# EAGLE design WAVESeeed (EAGLE 6.1)
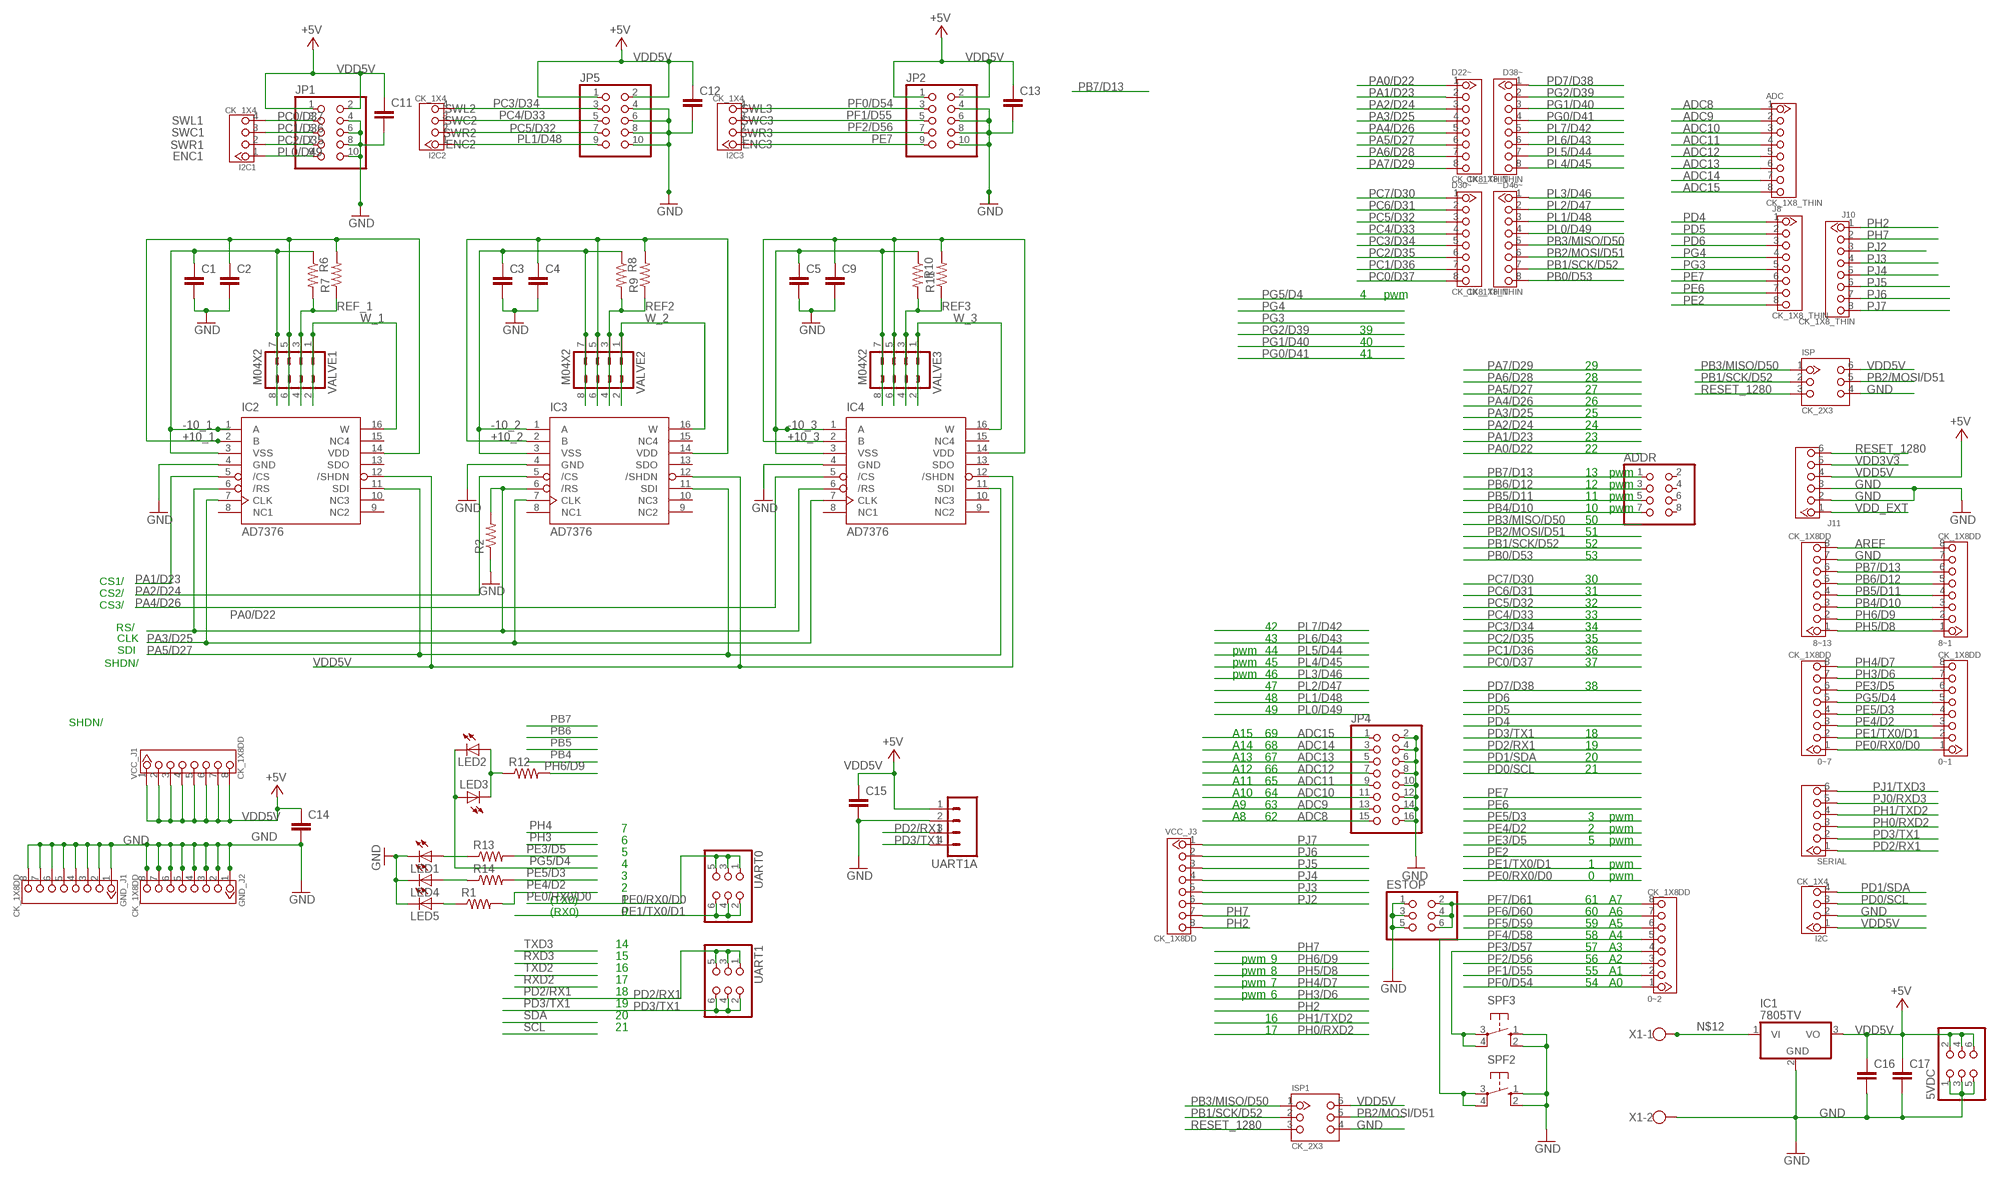
[diagram p0: schematic, sheet 1]

## Parts
0~1  CK_1X8DD  [CK_1X8]
0~2  CK_1X8DD  [CK_1X8]
0~7  CK_1X8DD  [CK_1X8]
5VDC  PINHD-2X3  [2X03]
8~1  CK_1X8DD  [CK_1X8]
8~13  CK_1X8DD  [CK_1X8]
ADC  CK_1X8_THIN  [CK_1X8_THIN]
ADDR  PINHD-2X4  [2X04]
C1  C-EUC1206  [C1206]
C2  C-EUC1206  [C1206]
C3  C-EUC1206  [C1206]
C4  C-EUC1206  [C1206]
C5  C-EUC1206  [C1206]
C9  C-EUC1206  [C1206]
C11  C-EUC1206  [C1206]
C12  C-EUC1206K  [C1206K]
C13  C-EUC1206K  [C1206K]
C14  C-EUC1206K  [C1206K]
C15  C-EUC1206  [C1206]
C16  C-EUC1206  [C1206]
C17  C-EUC1206K  [C1206K]
D22~  CK_1X8_THIN  [CK_1X8_THIN]
D30~  CK_1X8_THIN  [CK_1X8_THIN]
D38~  CK_1X8_THIN  [CK_1X8_THIN]
D46~  CK_1X8_THIN  [CK_1X8_THIN]
ESTOP  PINHD-2X3  [2X03]
GND_J1  CK_1X8DD  [CK_1X8]
GND_J2  CK_1X8DD  [CK_1X8]
I2C  CK_1X4  CK_1X4_DD  [CK_1X4]
I2C1  CK_1X4  CK_1X4_DD  [CK_1X4]
I2C2  CK_1X4  CK_1X4_DD  [CK_1X4]
I2C3  CK_1X4  CK_1X4_DD  [CK_1X4]
IC1  7805TV  [TO220V]
IC2  AD7376  [SO-16W]
IC3  AD7376  [SO-16W]
IC4  AD7376  [SO-16W]
ISP  CK_2X3  CK_2X3_THIN  [CK_2X3_THIN]
ISP1  CK_2X3  CK_2X3_THIN  [CK_2X3_THIN]
J8  CK_1X8_THIN  [CK_1X8_THIN]
J10  CK_1X8_THIN  [CK_1X8_THIN]
J11  CK_1X6  [CK_1X6]
JP1  PINHD-2X5  [2X05]
JP2  PINHD-2X5  [2X05]
JP4  PINHD-2X8  [2X08]
JP5  PINHD-2X5  [2X05]
LED1  LEDCHIPLED_1206  [CHIPLED_1206]
LED2  LEDCHIPLED_1206  [CHIPLED_1206]
LED3  LEDCHIPLED_1206  [CHIPLED_1206]
LED4  LEDCHIPLED_1206  [CHIPLED_1206]
LED5  LEDCHIPLED_1206  [CHIPLED_1206]
R1  R-US_R1206  [R1206]
R2  R-US_R1206  [R1206]
R6  R-US_M1206  [M1206]
R7  R-US_M1206  [M1206]
R8  R-US_M1206  [M1206]
R9  R-US_M1206  [M1206]
R10  R-US_M1206  [M1206]
R11  R-US_M1206  [M1206]
R12  R-US_R1206  [R1206]
R13  R-US_R1206  [R1206]
R14  R-US_R1206  [R1206]
SERIAL  CK_1X6  [CK_1X6]
SPF2  10-XX  [B3F-10XX]
SPF3  10-XX  [B3F-10XX]
UART0  PINHD-2X3  [2X03]
UART1  PINHD-2X3  [2X03]
UART1A  M04PTH  [1X04]
VALVE1  M04X2  [2X4]
VALVE2  M04X2  [2X4]
VALVE3  M04X2  [2X4]
VCC_J1  CK_1X8DD  [CK_1X8]
VCC_J3  CK_1X8DD  [CK_1X8]
X1  W237-102  [W237-102]

## Nets
+10_1: C2.1 IC2.2(B) IC2.14(VDD) R7.2 VALVE1.5 VALVE1.6
+10_2: C4.1 IC3.2(B) IC3.14(VDD) R9.2 VALVE2.5 VALVE2.6
+10_3: C9.1 IC4.2(B) IC4.14(VDD) R11.2 VALVE3.5 VALVE3.6
-10_1: C1.1 IC2.1(A) IC2.3(VSS) R6.1 VALVE1.7 VALVE1.8
-10_2: C3.1 IC3.1(A) IC3.3(VSS) R8.1 VALVE2.7 VALVE2.8
-10_3: C5.1 IC4.1(A) IC4.3(VSS) R10.1 VALVE3.7 VALVE3.8
ADC8: ADC.1 JP4.15
ADC9: ADC.2 JP4.13
ADC10: ADC.3 JP4.11
ADC11: ADC.4 JP4.9
ADC12: ADC.5 JP4.7
ADC13: ADC.6 JP4.5
ADC14: ADC.7 JP4.3
ADC15: ADC.8 JP4.1
AREF: 8~1.8 8~13.8
GND: 5VDC.1 5VDC.3 5VDC.5 8~1.7 8~13.7 C1.2 C2.2 C3.2 C4.2 C5.2 C9.2 C11.2 C12.2 C13.2 C14.2 C15.2 C16.2 C17.2 ESTOP.1 ESTOP.3 ESTOP.5 GND_J1.1 GND_J1.2 GND_J1.3 GND_J1.4 GND_J1.5 GND_J1.6 GND_J1.7 GND_J1.8 GND_J2.1 GND_J2.2 GND_J2.3 GND_J2.4 GND_J2.5 GND_J2.6 GND_J2.7 GND_J2.8 I2C.2 IC1.2(GND) IC2.4(GND) IC3.4(GND) IC4.4(GND) ISP1.4 ISP.4 J11.2 J11.3 JP1.4 JP1.6 JP1.8 JP1.10 JP2.4 JP2.6 JP2.8 JP2.10 JP4.2 JP4.4 JP4.6 JP4.8 JP4.10 JP4.12 JP4.14 JP4.16 JP5.4 JP5.6 JP5.8 JP5.10 LED1.C LED4.C LED5.C R2.1 SPF2.1(S) SPF2.2(S1) SPF3.1(S) SPF3.2(S1) UART1A.2 X1.2
N$1: LED2.A LED3.C R12.1
N$5: LED1.A R13.1
N$6: LED5.A R1.1
N$7: LED4.A R14.1
N$12: IC1.1(VI) X1.1
PA0/D22: D22~.1 IC2.6(/RS) IC3.6(/RS) IC4.6(/RS) R2.2
PA1/D23: D22~.2 IC2.5(/CS)
PA2/D24: D22~.3 IC3.5(/CS)
PA3/D25: D22~.4 IC2.7(CLK) IC3.7(CLK) IC4.7(CLK)
PA4/D26: D22~.5 IC4.5(/CS)
PA5/D27: D22~.6 IC2.11(SDI) IC3.11(SDI) IC4.11(SDI)
PA6/D28: D22~.7
PA7/D29: D22~.8
PB0/D53: D46~.8
PB1/SCK/D52: D46~.7 ISP1.2 ISP.2
PB2/MOSI/D51: D46~.6 ISP1.5 ISP.5
PB3/MISO/D50: D46~.5 ISP1.1 ISP.1
PB4/D10: 8~1.3 8~13.3 ADDR.7
PB5/D11: 8~1.4 8~13.4 ADDR.5
PB6/D12: 8~1.5 8~13.5 ADDR.3
PB7/D13: 8~1.6 8~13.6 ADDR.1
PC0/D37: D30~.8 I2C1.4 JP1.3
PC1/D36: D30~.7 I2C1.3 JP1.5
PC2/D35: D30~.6 I2C1.2 JP1.7
PC3/D34: D30~.5 I2C2.4 JP5.3
PC4/D33: D30~.4 I2C2.3 JP5.5
PC5/D32: D30~.3 I2C2.2 JP5.7
PC6/D31: D30~.2
PC7/D30: D30~.1
PD0/SCL: I2C.3
PD1/SDA: I2C.4
PD2/RX1: SERIAL.1 UART1.1 UART1.3 UART1.5 UART1A.3
PD3/TX1: SERIAL.2 UART1.2 UART1.4 UART1.6 UART1A.4
PD4: J8.1
PD5: J8.2
PD6: J8.3
PD7/D38: D38~.1
PE0/RX0/D0: 0~1.1 0~7.1 UART0.1 UART0.3 UART0.5
PE1/TX0/D1: 0~1.2 0~7.2 UART0.2 UART0.4 UART0.6
PE2: J8.8
PE3/D5: 0~1.6 0~7.6 R13.2
PE4/D2: 0~1.3 0~7.3 R1.2
PE5/D3: 0~1.4 0~7.4 R14.2
PE6: J8.7
PE7: I2C3.1 J8.6 JP2.9
PF0/D54: 0~2.1 I2C3.4 JP2.3
PF1/D55: 0~2.2 I2C3.3 JP2.5
PF2/D56: 0~2.3 I2C3.2 JP2.7
PF3/D57: 0~2.4 SPF3.3(P) SPF3.4(P1)
PF4/D58: 0~2.5 SPF2.3(P) SPF2.4(P1)
PF5/D59: 0~2.6
PF6/D60: 0~2.7
PF7/D61: 0~2.8 ESTOP.2 ESTOP.4 ESTOP.6
PG0/D41: D38~.4
PG1/D40: D38~.3
PG2/D39: D38~.2
PG3: J8.5
PG4: J8.4
PG5/D4: 0~1.5 0~7.5 LED2.C LED3.A
PH0/RXD2: SERIAL.3
PH1/TXD2: SERIAL.4
PH2: J10.1 VCC_J3.8
PH3/D6: 0~1.7 0~7.7
PH4/D7: 0~1.8 0~7.8
PH5/D8: 8~1.1 8~13.1
PH6/D9: 8~1.2 8~13.2 R12.2
PH7: J10.2 VCC_J3.7
PJ0/RXD3: SERIAL.5
PJ1/TXD3: SERIAL.6
PJ2: J10.3 VCC_J3.6
PJ3: J10.4 VCC_J3.5
PJ4: J10.5 VCC_J3.4
PJ5: J10.6 VCC_J3.3
PJ6: J10.7 VCC_J3.2
PJ7: J10.8 VCC_J3.1
PL0/D49: D46~.4 I2C1.1 JP1.9
PL1/D48: D46~.3 I2C2.1 JP5.9
PL2/D47: D46~.2
PL3/D46: D46~.1
PL4/D45: D38~.8
PL5/D44: D38~.7
PL6/D43: D38~.6
PL7/D42: D38~.5
REF2: R8.2 R9.1 VALVE2.3 VALVE2.4
REF3: R10.2 R11.1 VALVE3.3 VALVE3.4
REF_1: R6.2 R7.1 VALVE1.3 VALVE1.4
RESET_1280: ISP1.3 ISP.3 J11.6
VDD3V3: J11.5
VDD5V: 5VDC.2 5VDC.4 5VDC.6 C11.1 C12.1 C13.1 C14.1 C15.1 C16.1 C17.1 I2C.1 IC1.3(VO) IC2.12(/SHDN) IC3.12(/SHDN) IC4.12(/SHDN) ISP1.6 ISP.6 J11.4 JP1.1 JP1.2 JP2.1 JP2.2 JP5.1 JP5.2 UART1A.1 VCC_J1.1 VCC_J1.2 VCC_J1.3 VCC_J1.4 VCC_J1.5 VCC_J1.6 VCC_J1.7 VCC_J1.8 ; supply symbol labelled +5V
VDD_EXT: J11.1
W_1: IC2.16(W) VALVE1.1 VALVE1.2
W_2: IC3.16(W) VALVE2.1 VALVE2.2
W_3: IC4.16(W) VALVE3.1 VALVE3.2
Unconnected: ADDR.2 ADDR.4 ADDR.6 ADDR.8 IC2.8(NC1) IC2.9(NC2) IC2.10(NC3) IC2.13(SDO) IC2.15(NC4) IC3.8(NC1) IC3.9(NC2) IC3.10(NC3) IC3.13(SDO) IC3.15(NC4) IC4.8(NC1) IC4.9(NC2) IC4.10(NC3) IC4.13(SDO) IC4.15(NC4)

## Notes on the sheet
- SWL2 | SWL3
- SWL1 | SWC2 | SWC3
- SWC1 | SWR2 | SWR3
- SWR1 | ENC2 | ENC3
- ENC1
- 4 | pwm
- 39
- 40
- 41
- 29
- 28
- 27
- 26
- 25
- 24
- 23
- 22
- 13 | pwm
- 12 | pwm
- 11 | pwm
- 10 | pwm
- 50
- 51
- 52
- 53
- CS1/ | 30
- CS2/ | 31
- CS3/ | 32
- 33
- RS/ | 42 | 34
- CLK | 43 | 35
- SDI | pwm | 44 | 36
- SHDN/ | pwm | 45 | 37
- pwm | 46
- 47 | 38
- 48
- 49
- SHDN/
- A15 | 69 | 18
- A14 | 68 | 19
- A13 | 67 | 20
- A12 | 66 | 21
- A11 | 65
- A10 | 64
- A9 | 63
- A8 | 62 | 3 | pwm
- 7 | 2 | pwm
- 6 | 5 | pwm
- 5
- 4 | 1 | pwm
- 3 | 0 | pwm
- 2
- (TX0) | 1 | 61 | A7
- (RX0) | 0 | 60 | A6
- 59 | A5
- 58 | A4
- 14 | 57 | A3
- 15 | pwm | 9 | 56 | A2
- 16 | pwm | 8 | 55 | A1
- 17 | pwm | 7 | 54 | A0
- 18 | pwm | 6
- 19
- 20 | 16
- 21 | 17

## Library data of the parts
0~1 0~2 0~7 8~1 8~13 ADC D22~ D30~ D38~ D46~ GND_J1 GND_J2 J8 J10 VCC_J1 VCC_J3 = CONNECTER:CK_1X8
5VDC ESTOP UART0 UART1 = pinhead:PINHD-2X3: PIN HEADER
ADDR = pinhead:PINHD-2X4: PIN HEADER
C1-C5 C9 C11-C17 = rcl:C-EU: CAPACITOR, European symbol
I2C I2C1-I2C3 = CONNECTER:CK_1X4
IC1 = linear:78*: Positive VOLTAGE REGULATOR Source: http://cache.national.com/ds/LM/LM78L05.pdf http://www.fairchildsemi.com/ds/LM/LM7805.pdf
IC2-IC4 = analog-devices:AD7376: Digital pot
ISP ISP1 = CONNECTER:CK_2X3
J11 SERIAL = CONNECTER:CK_1X6
JP1 JP2 JP5 = pinhead:PINHD-2X5: PIN HEADER
JP4 = pinhead:PINHD-2X8: PIN HEADER
LED1-LED5 = led:LED: LED OSRAM: - CHIPLED LG R971, LG N971, LY N971, LG Q971, LY Q971, LO R971, LY R971 LH N974, LH R974 LS Q976, LO Q976, LY Q976 LO Q996 - Hyper CHIPLED LW Q18S LB Q993, LB Q99A, LB R99A - SideLED LS A670, LO A670, LY A670, LG A670, LP A670 LB A673, LV A673, LT A673, LW A673 LH A674 LY A675 LS A676, LA A676, LO A676, LY A676, LW A676 LS A679, LY A679, LG A679 - Hyper Micro SIDELED® LS Y876, LA Y876, LO Y876, LY Y876 LT Y87S - SmartLED LW L88C, LW L88S LB L89C, LB L89S, LG L890 LS L89K, LO L89K, LY L89K LS L896, LA L896, LO L896, LY L896 - TOPLED LS T670, LO T670, LY T670, LG T670, LP T670 LSG T670, LSP T670, LSY T670, LOP T670, LYG T670 LG T671, LOG T671, LSG T671 LB T673, LV T673, LT T673, LW T673 LH T674 LS T676, LA T676, LO T676, LY T676, LB T676, LH T676, LSB T676, LW T676 LB T67C, LV T67C, LT T67C, LS T67K, LO T67K, LY T67K, LW E67C LS E67B, LA E67B, LO E67B, LY E67B, LB E67C, LV E67C, LT E67C LW T67C LS T679, LY T679, LG T679 LS T770, LO T770, LY T770, LG T770, LP T770 LB T773, LV T773, LT T773, LW T773 LH T774 LS E675, LA E675, LY E675, LS T675 LS T776, LA T776, LO T776, LY T776, LB T776 LHGB T686 LT T68C, LB T68C - Hyper Mini TOPLED® LB M676 - Mini TOPLED Santana® LG M470 LS M47K, LO M47K, LY M47K Source: http://www.osram.convergy.de LUXEON: - LUMILED® LXK2-PW12-R00, LXK2-PW12-S00, LXK2-PW14-U00, LXK2-PW14-V00 LXK2-PM12-R00, LXK2-PM12-S00, LXK2-PM14-U00 LXK2-PE12-Q00, LXK2-PE12-R00, LXK2-PE12-S00, LXK2-PE14-T00, LXK2-PE14-U00 LXK2-PB12-K00, LXK2-PB12-L00, LXK2-PB12-M00, LXK2-PB14-N00, LXK2-PB14-P00, LXK2-PB14-Q00 LXK2-PR12-L00, LXK2-PR12-M00, LXK2-PR14-Q00, LXK2-PR14-R00 LXK2-PD12-Q00, LXK2-PD12-R00, LXK2-PD12-S00 LXK2-PH12-R00, LXK2-PH12-S00 LXK2-PL12-P00, LXK2-PL12-Q00, LXK2-PL12-R00 Source: www.luxeon.com KINGBRIGHT: KA-3528ASYC Source: www.kingbright.com
R1 R2 R6-R14 = resistor:R-US_: RESISTOR, American symbol
SPF2 SPF3 = switch-omron:10-XX: OMRON SWITCH; MPN: B3F-1000; OC_FARNELL: 176432; OC_NEWARK: 36M3542
UART1A = SparkFun-Connectors:M04: Header 4 Standard 4-pin 0.1" header. Use with straight break away headers (SKU : PRT-00116), right angle break away headers (PRT-00553), swiss pins (PRT-00743), machine pins (PRT-00117), and female headers (PRT-00115). Molex polarized connector foot print use with SKU : PRT-08231 with associated crimp pins and housings. 1MM SMD Version SKU: PRT-10208
VALVE1-VALVE3 = SparkFun-Connectors:M04X2: .1" header, two rows of four.
X1 = con-wago-500:W237-102: WAGO SCREW CLAMP; MPN: 237-102; OC_FARNELL: unknown; OC_NEWARK: 70K9898

## Net classes
0 default: width 0.152 mm, drill 0.305 mm, clearance 0.152 mm

## Board
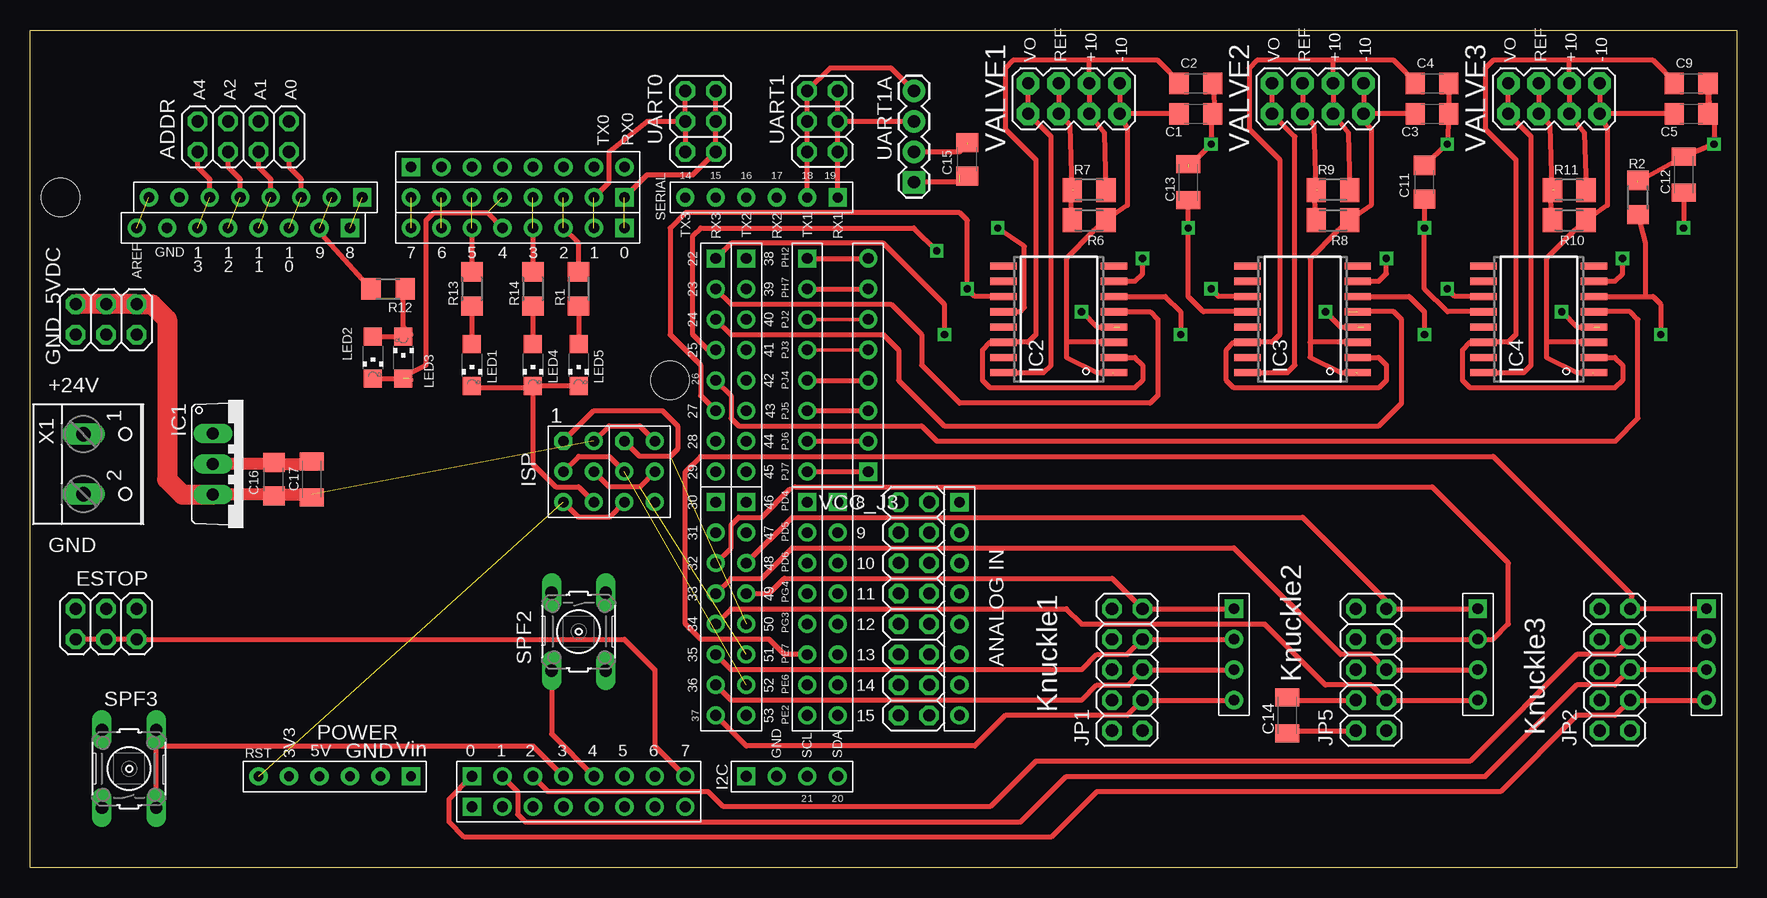
[diagram p1: board, top side]
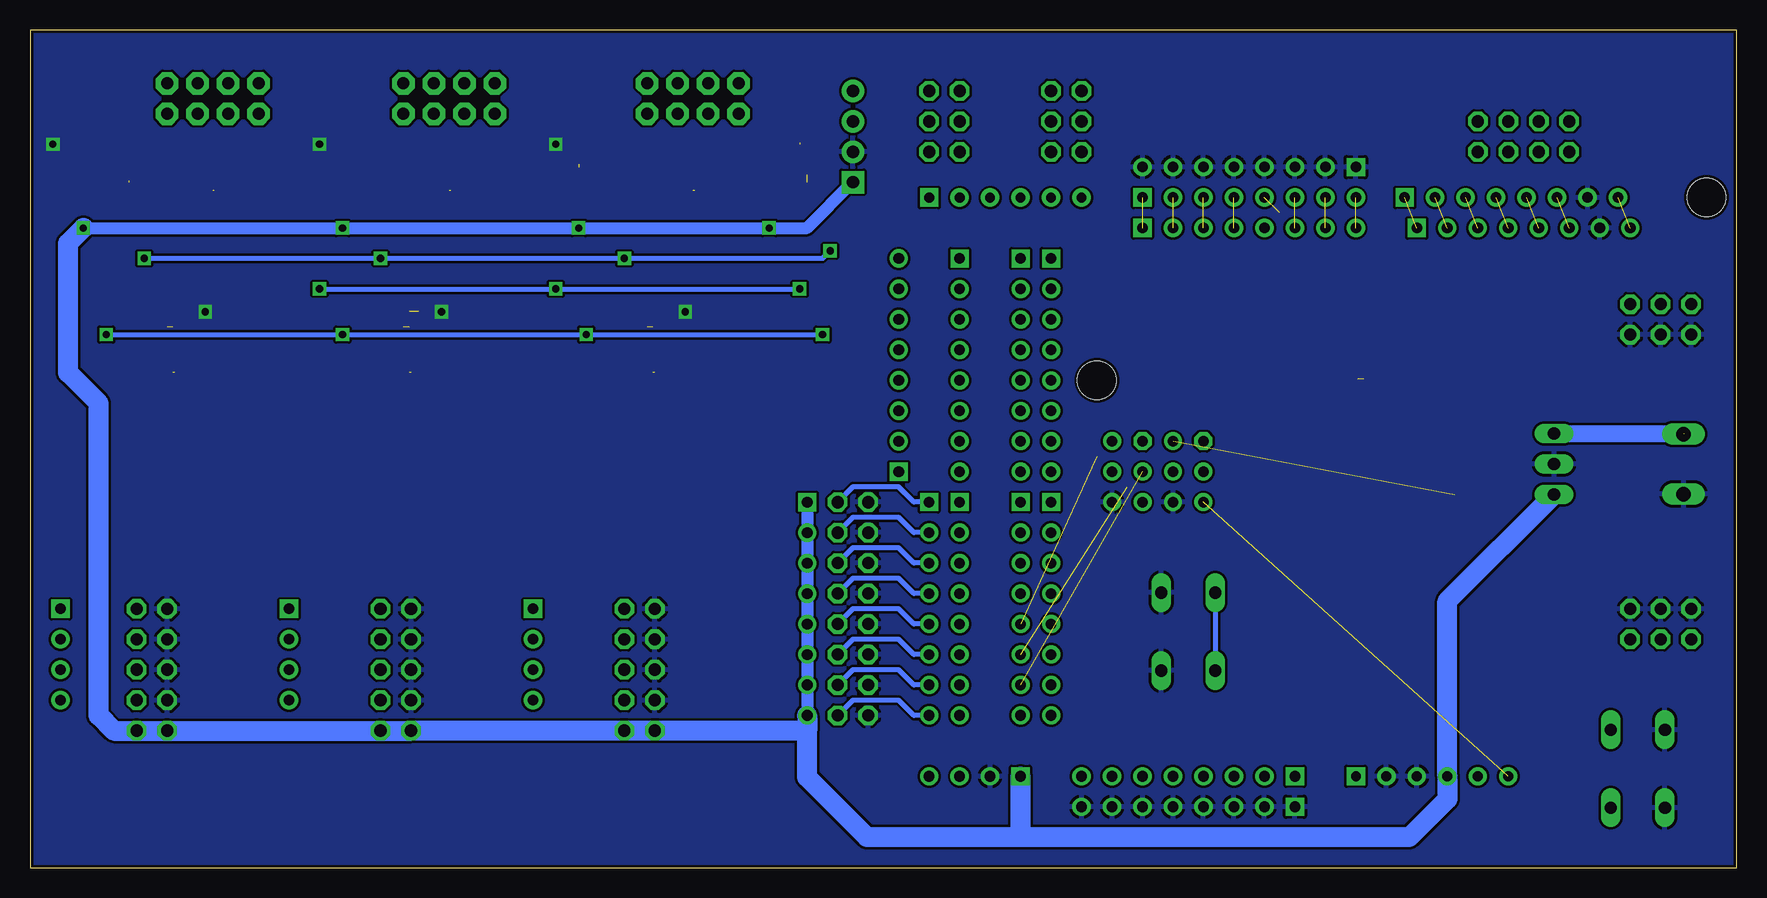
[diagram p2: board, bottom side, seen from below]

Size 142.24 x 69.85 mm. Coordinates in mm from the lower left corner, seen from the top.
Outline: 142.24,69.85 142.24,0 0,0 0,69.85 142.24,69.85
Copper layers (1*16): Top 0.035mm / dielectric 1.5mm / Bottom 0.035mm
Design rules: minimum track width 8mil, minimum drill 20mil, track to track 8mil, track to pad 8mil, pad to pad 8mil, via to via 8mil, smd to smd 8mil, copper to edge 10mil, drill to drill 8mil, minimum pad ring 12mil, minimum via ring 10mil, stop-mask expansion 4mil, vias tented up to drill 25mil, thermal gap 10mil
Holes 3.2 mm at 2.54,55.88 53.34,40.64
tRestrict: area 4.6,54.4 to 8.4,57.4

### Footprints (pad centres in the part's own frame; a part is rotated, then mirrored left to right if it is on the bottom)
CK_1X8 = drill 0.889 pad 1.524 square: 1 0,8.89 | drill 0.889 pad 1.524: 2 0,6.35; 3 0,3.81; 4 0,1.27; 5 0,-1.27; 6 0,-3.81; 7 0,-6.35; 8 0,-8.89
2X03 = drill 1.016 octagon: 1 -2.54,-1.27; 2 -2.54,1.27; 3 0,-1.27; 4 0,1.27; 5 2.54,-1.27; 6 2.54,1.27
CK_1X8_THIN = drill 0.889 pad 1.397 square: 1 0,8.89 | drill 0.889 pad 1.397: 2 0,6.35; 3 0,3.81; 4 0,1.27; 5 0,-1.27; 6 0,-3.81; 7 0,-6.35; 8 0,-8.89
2X04 = drill 1.016 octagon: 1 -3.81,-1.27; 2 -3.81,1.27; 3 -1.27,-1.27; 4 -1.27,1.27; 5 1.27,-1.27; 6 1.27,1.27; 7 3.81,-1.27; 8 3.81,1.27
C1206 = smd 1.6 x 1.8: 1 -1.4,0; 2 1.4,0
C1206K = smd 1.5 x 2: 1 -1.5,0; 2 1.5,0
CK_1X4 = drill 0.889 pad 1.524 square: 1 0,3.81 | drill 0.889 pad 1.524: 2 0,1.27; 3 0,-1.27; 4 0,-3.81
TO220V = drill 1.016 long: 1 -2.54,-2.54; 2 0,-2.54; 3 2.54,-2.54
SO-16W = smd 0.6 x 2.2: 1 -4.445,-4.6; 2 -3.175,-4.6; 3 -1.905,-4.6; 4 -0.635,-4.6; 5 0.635,-4.6; 6 1.905,-4.6; 7 3.175,-4.6; 8 4.445,-4.6; 9 4.445,4.6; 10 3.175,4.6; 11 1.905,4.6; 12 0.635,4.6; 13 -0.635,4.6; 14 -1.905,4.6; 15 -3.175,4.6; 16 -4.445,4.6
CK_2X3_THIN = drill 0.889 pad 1.397 octagon: 1 -1.27,2.54 | drill 0.889 pad 1.397: 2 -1.27,0; 3 -1.27,-2.54; 4 1.27,-2.54; 5 1.27,0; 6 1.27,2.54
CK_1X6@1 = drill 0.813 pad 1.524 square: 1 0,6.35 | drill 0.813 pad 1.524: 2 0,3.81; 3 0,1.27; 4 0,-1.27; 5 0,-3.81; 6 0,-6.35
2X05 = drill 1.016 octagon: 1 -5.08,-1.27; 2 -5.08,1.27; 3 -2.54,-1.27; 4 -2.54,1.27; 5 0,-1.27; 6 0,1.27; 7 2.54,-1.27; 8 2.54,1.27; 9 5.08,-1.27; 10 5.08,1.27
2X08 = drill 1.016 octagon: 1 -8.89,-1.27; 2 -8.89,1.27; 3 -6.35,-1.27; 4 -6.35,1.27; 5 -3.81,-1.27; 6 -3.81,1.27; 7 -1.27,-1.27; 8 -1.27,1.27; 9 1.27,-1.27; 10 1.27,1.27; 11 3.81,-1.27; 12 3.81,1.27; 13 6.35,-1.27; 14 6.35,1.27; 15 8.89,-1.27; 16 8.89,1.27
CHIPLED_1206 = smd 1.5 x 1.5: A 0,-1.75; C 0,1.75
R1206 = smd 1.6 x 1.803: 1 -1.422,0; 2 1.422,0
M1206 = smd 1.6 x 2: 1 -1.4,0; 2 1.4,0
B3F-10XX = drill 1.016 long: 1 -3.251,2.261; 2 3.251,2.261; 3 -3.251,-2.261; 4 3.251,-2.261
1X04 = drill 1.016 pad 1.88 square: 1 0,0 | drill 1.016 pad 1.88: 2 2.54,0; 3 5.08,0; 4 7.62,0
2X4 = drill 1.016 pad 1.88 octagon: 1 -3.81,-1.27; 2 -3.81,1.27; 3 -1.27,-1.27; 4 -1.27,1.27; 5 1.27,-1.27; 6 1.27,1.27; 7 3.81,-1.27; 8 3.81,1.27
W237-102 = drill 1.194 long: 1 -2.5,-1.27; 2 2.5,-1.27

### Placement (x,y rotation side)
0~1  40.64,53.34 270 top
0~2  45.72,7.62 90 top
0~7  40.64,55.88 270 top
5VDC  6.35,45.72 0 top
8~1  17.78,53.34 270 top
8~13  18.8,55.88 270 top
ADC  67.31,21.59 0 top
ADDR  17.78,60.96 0 top
C1  97.16,62.87 0 top
C2  97.16,65.41 0 top
C3  116.84,62.87 0 top
C4  116.84,65.41 0 top
C5  138.43,62.87 0 top
C9  138.43,65.41 0 top
C11  116.2,57.15 90 top
C12  137.79,57.78 90 top
C13  96.52,57.15 90 top
C14  104.78,12.7 90 top
C15  78.11,59.05 90 top
C16  20.32,32.38 90 top
C17  23.5,32.38 90 top
D22~  57.15,41.91 0 top
D30~  57.15,21.59 0 top
D38~  59.69,41.91 0 top
D46~  59.69,21.59 0 top
ESTOP  6.35,20.32 180 top
GND_J1  45.72,5.08 90 top
GND_J2  40.64,58.42 90 top
I2C  63.5,7.62 90 top
I2C1  100.33,17.78 0 top
I2C2  120.65,17.78 0 top
I2C3  139.7,17.78 0 top
IC1  17.78,33.66 270 top
IC2  85.72,45.72 90 top
IC3  106.05,45.72 90 top
IC4  125.73,45.72 90 top
ISP  50.8,33.02 0 top
ISP1  45.72,33.02 0 top
J8  64.77,21.59 0 top
J10  64.77,41.91 0 top
J11  [CK_1X6@1]  25.4,7.62 270 top
JP1  91.44,16.51 90 top
JP2  132.08,16.51 90 top
JP4  73.66,21.59 90 top
JP5  111.76,16.51 90 top
LED1  36.83,41.91 180 top
LED2  28.57,42.55 180 top
LED3  31.11,42.55 0 top
LED4  41.91,41.91 180 top
LED5  45.72,41.91 180 top
R1  45.72,48.26 90 top
R2  133.99,55.88 270 top
R6  88.27,53.98 180 top
R7  88.27,56.52 0 top
R8  108.58,53.98 180 top
R9  108.58,56.52 0 top
R10  128.27,53.98 180 top
R11  128.27,56.52 0 top
R12  29.84,48.26 180 top
R13  36.83,48.26 90 top
R14  41.91,48.26 90 top
SERIAL  [CK_1X6@1]  60.96,55.88 270 top
SPF2  45.72,19.68 270 top
SPF3  8.26,8.26 90 top
UART0  55.88,62.23 90 top
UART1  66.04,62.23 90 top
UART1A  73.66,57.15 90 top
VALVE1  87,64.14 0 top
VALVE2  107.31,64.14 0 top
VALVE3  127,64.14 0 top
VCC_J1  77.47,21.59 0 top
VCC_J3  69.85,41.91 180 top
X1  5.71,33.66 270 top

### Tracks (layer width: path | path; a pad name or v marks a point on that pad's centre or on a via)
+10_1
  Top 0.406: 88.27,67.31 VALVE1.6 VALVE1.5 89.53,61.28 R7.2 | 88.27,67.31 81.92,67.31 81.28,66.67 81.28,61.59 83.82,59.05 83.82,44.45 83.19,43.81 IC2.14 80.01,43.81 79.38,43.18 79.38,40.64 80.01,40.01 92.08,40.01 92.71,40.64 92.71,41.91 92.08,42.55 IC2.2 | C2.1 94.94,66.36 93.98,67.31 88.27,67.31
+10_2
  Top 0.406: 108.58,67.31 VALVE2.6 VALVE2.5 109.86,61.28 R9.2 | 108.58,67.31 102.23,67.31 101.6,66.67 101.6,61.59 104.14,59.05 104.14,44.45 103.5,43.81 IC3.14 100.33,43.81 99.69,43.18 99.69,40.64 100.33,40.01 112.39,40.01 113.03,40.64 113.03,41.91 112.39,42.55 IC3.2 | C4.1 114.62,66.36 113.67,67.31 108.58,67.31
+10_3
  Top 0.406: 128.27,67.31 VALVE3.6 VALVE3.5 129.54,61.28 R11.2 | 128.27,67.31 121.92,67.31 121.28,66.67 121.28,61.59 123.83,59.05 123.83,44.45 123.19,43.81 IC4.14 120.02,43.81 119.38,43.18 119.38,40.64 120.02,40.01 132.08,40.01 132.72,40.64 132.72,41.91 132.08,42.55 IC4.2 | C9.1 136.21,66.36 135.25,67.31 128.27,67.31
-10_1  (1 unrouted)
  Top 0.406: VALVE1.8 VALVE1.7 | VALVE1.7 91.44,61.59 91.44,55.24 R6.1 | R6.1 89.22,53.66 | R6.1 88.58,53.02 86.36,50.8 86.36,43.81 | 86.36,43.81 86.36,42.55 88.9,41.27 90.17,41.27 | IC2.3 86.36,43.81 | C1.1 VALVE1.7
-10_2  (1 unrouted)
  Top 0.406: VALVE2.8 VALVE2.7 | VALVE2.7 111.12,62.23 111.76,61.59 111.76,55.24 R8.1 | R8.1 110.17,54.29 | R8.1 108.9,53.02 106.68,50.8 106.68,43.81 | 106.68,43.81 106.68,42.55 109.22,41.27 110.49,41.27 | IC3.3 106.68,43.81 | C3.1 VALVE2.7
-10_3  (1 unrouted)
  Top 0.406: VALVE3.8 VALVE3.7 | VALVE3.7 131.44,61.59 131.44,55.24 R10.1 | R10.1 129.22,53.66 | R10.1 128.59,53.02 126.36,50.8 126.36,43.81 | 126.36,43.81 126.36,42.55 128.91,41.27 130.18,41.27 | IC4.3 126.36,43.81 | C5.1 VALVE3.7
ADC8
  Bottom 0.406: ADC.1 68.58,30.48 69.85,31.75 73.66,31.75 JP4.15
ADC9
  Bottom 0.406: ADC.2 68.58,27.94 69.85,29.21 73.66,29.21 JP4.13
ADC10
  Bottom 0.406: ADC.3 68.58,25.4 69.85,26.67 73.66,26.67 JP4.11
ADC11
  Bottom 0.406: ADC.4 68.58,22.86 69.85,24.13 73.66,24.13 JP4.9
ADC12
  Bottom 0.406: ADC.5 68.58,20.32 69.85,21.59 73.66,21.59 JP4.7
ADC13
  Bottom 0.406: ADC.6 68.58,17.78 69.85,19.05 73.66,19.05 JP4.5
ADC14
  Bottom 0.406: ADC.7 68.58,15.24 69.85,16.51 73.66,16.51 JP4.3
ADC15
  Bottom 0.406: ADC.8 68.58,12.7 69.85,13.97 73.66,13.97 JP4.1
AREF  (1 unrouted)
GND  (via drill 0.6)  (6 unrouted)
  Top 0.406: 41.91,40.01 LED4.C LED5.C | 41.91,40.01 36.98,40.01 LED1.C | 41.91,40.01 41.91,33.66 43.81,31.75 45.72,31.75 ISP1.4 | C2.2 98.74,63.18 98.42,62.87 | v87.63,46.35 88.9,45.09 90.81,45.09 | v107.95,46.35 109.22,45.09 111.12,45.09 | v127.64,46.35 128.91,45.09 130.81,45.09 | C4.2 C3.2 v118.11,60.33 C11.2 | C5.2 C9.2 140.01,62.55 140.34,62.23 v140.34,60.33 C12.2 133.99,57.15 | C1.2 98.42,62.87 | 98.42,62.87 v98.42,60.33 96.52,58.42 | UART1A.2 77.47,59.69 78.11,60.33 | C14.2 104.78,13.97 JP5.4
  Top 1.016: 20.32,33.66 23.5,33.66 C17.2 | C16.2 20.32,33.66 | 20.32,33.66 IC1.2
  pour Bottom: 142.24,69.85 142.24,0 73.66,-0.51 0,0.13 0,36.7 0.25,69.72
N$1
  Top 0.406: LED2.A LED3.C 31.75,44.45 31.11,45.09 31.11,48.11 R12.1
N$5
  Top 0.406: R13.1 LED1.A
N$6
  Top 0.406: R1.1 LED5.A
N$7
  Top 0.406: 41.91,46.99 R14.1 LED4.A
N$12  (1 unrouted)
  Bottom 1.422: IC1.1 4.45,36.2
PA0/D22  (via drill 0.6)
  Top 0.406: v76.2,44.45 76.2,46.99 71.12,52.07 58.42,52.07 D22~.1 | IC2.6 94.61,47.62 95.89,46.35 v95.89,44.45 | IC4.6 134.62,47.62 | 134.62,47.62 135.25,47.62 135.89,46.99 v135.89,44.45 | IC3.6 114.94,47.62 116.2,46.35 v116.2,44.45 | R2.2 134.62,52.07 134.62,47.62
  Bottom 0.406: v135.89,44.45 v116.2,44.45 v95.89,44.45 v76.2,44.45
PA1/D23
  Top 0.406: D22~.2 58.42,46.99 71.75,46.99 74.3,44.45 74.3,41.91 77.47,38.73 93.34,38.73 93.98,39.37 93.98,45.72 93.34,46.35 IC2.5
PA2/D24  (1 unrouted)
  Top 0.406: D22~.3 58.42,44.45 71.12,44.45 72.39,43.18 72.39,40.64 76.2,36.83 112.39,36.83 114.3,38.73 114.3,45.72 113.67,46.35 109.86,46.35
PA3/D25  (via drill 0.6)
  Top 0.406: D22~.4 56.52,43.18 55.24,44.45 55.24,52.7 55.88,53.34 73.66,53.34 v75.56,51.44 | IC2.7 92.08,48.9 92.71,49.53 v92.71,50.8 | IC3.7 112.39,48.9 113.03,49.53 v113.03,50.8 | IC4.7 132.08,48.9 132.72,49.53 v132.72,50.8
  Bottom 0.406: v132.72,50.8 v113.03,50.8 v92.71,50.8 76.2,50.8 v75.56,51.44
PA4/D26
  Top 0.406: D22~.5 58.42,39.37 58.42,37.47 59.05,36.83 74.3,36.83 75.56,35.56 127.6,35.56 127.65,35.56 127.67,35.56 127.69,35.56 132.14,35.57 133.99,37.47 133.99,45.72 133.35,46.35 IC4.5
PA5/D27  (via drill 0.6)
  Top 0.406: IC2.11 78.74,47.62 v78.11,48.26 78.11,53.98 77.47,54.61 54.61,54.61 53.34,53.34 53.34,44.45 55.88,41.91 55.88,39.37 D22~.6 | IC3.11 99.06,47.62 v98.42,48.26 | IC4.11 118.75,47.62 v118.11,48.26
  Bottom 0.406: v78.11,48.26 v98.42,48.26 v118.11,48.26
PB1/SCK/D52  (1 unrouted)
  Top 0.406: ISP1.2 45.72,34.29 48.26,34.29 ISP.2
PB2/MOSI/D51  (1 unrouted)
  Top 0.406: ISP.5 50.8,31.75 48.26,31.75 ISP1.5
PB3/MISO/D50  (1 unrouted)
  Top 0.406: ISP1.1 46.99,38.1 52.7,38.1 53.98,36.83 53.98,34.92 53.34,34.29 50.8,34.29 ISP.1
PB4/D10  (1 unrouted)
  Top 0.406: 8~13.3 22.61,57.4 21.59,58.42 ADDR.7
PB5/D11  (1 unrouted)
  Top 0.406: 8~13.4 20.07,57.4 19.05,58.42 ADDR.5
PB6/D12  (1 unrouted)
  Top 0.406: 8~13.5 17.53,57.4 16.51,58.42 ADDR.3
PB7/D13  (1 unrouted)
  Top 0.406: 8~13.6 14.99,57.4 13.97,58.42 ADDR.1
PC0/D37
  Top 0.406: D30~.8 59.69,10.16 78.74,10.16 81.28,12.7 91.44,12.7 JP1.3 I2C1.4
PC1/D36
  Top 0.406: D30~.7 58.42,13.97 87.63,13.97 88.9,15.24 91.57,15.24 JP1.5 I2C1.3
PC2/D35
  Top 0.406: D30~.6 58.42,16.51 87.63,16.51 88.9,17.78 91.44,17.78 JP1.7 I2C1.2
PC3/D34
  Top 0.406: D30~.5 58.42,21.59 86.36,21.59 87.63,20.32 102.87,20.32 107.95,15.24 111.76,15.24 JP5.3 I2C2.4
PC4/D33
  Top 0.406: D30~.4 58.42,24.13 60.96,24.13 63.5,26.67 100.33,26.67 109.22,17.78 111.76,17.78 JP5.5 I2C2.3
PC5/D32
  Top 0.305: 63.31,31.56 63.76,31.75
  Top 0.406: D30~.3 58.42,26.67 58.42,28.57 59.05,29.21 60.96,29.21 63.31,31.56 | 63.76,31.75 116.84,31.75 123.19,25.4 123.19,20.32 121.92,19.05 I2C2.2 JP5.7
PD2/RX1
  Top 0.406: SERIAL.1 UART1.1 UART1.3 | UART1.3 UART1.5 | UART1.3 UART1A.3
PD3/TX1
  Top 0.406: SERIAL.2 UART1.2 UART1.4 UART1.6 66.67,66.67 71.75,66.67 UART1A.4
PE0/RX0/D0  (1 unrouted)
  Top 0.406: 0~7.1 51.44,57.78 55.24,57.78 UART0.1 UART0.3 UART0.5
PE1/TX0/D1  (1 unrouted)
  Top 0.406: 0~7.2 48.26,57.15 48.26,59.69 51.44,62.23 UART0.4 | UART0.4 UART0.6 | UART0.4 UART0.2
PE3/D5  (1 unrouted)
  Top 0.406: 0~1.6 R13.2
PE4/D2  (1 unrouted)
  Top 0.406: R1.2 45.72,52.07 0~1.3
PE5/D3  (1 unrouted)
  Top 0.406: 0~1.4 R14.2
PE7
  Top 0.406: J8.6 62.87,17.78 61.59,19.05 55.88,19.05 54.61,20.32 54.61,33.02 55.88,34.29 121.92,34.29 133.48,22.73 JP2.9 I2C3.1
PF0/D54
  Top 0.406: 0~2.1 34.92,5.71 34.92,3.81 36.2,2.54 85.09,2.54 88.9,6.35 122.56,6.35 128.91,12.7 132.08,12.7 JP2.3 I2C3.4
PF1/D55
  Top 0.406: 0~2.2 40.64,6.35 40.64,4.45 41.27,3.81 82.55,3.81 86.36,7.62 121.28,7.62 128.91,15.24 132.08,15.24 JP2.5 I2C3.3
PF2/D56
  Top 0.406: 0~2.3 43.18,6.35 56.52,6.35 57.78,5.08 80.01,5.08 83.82,8.89 120.02,8.89 128.91,17.78 132.08,17.78 JP2.7 I2C3.2
PF3/D57
  Top 0.406: 0~2.4 41.91,10.16 10.52,10.16 | SPF3.3 10.52,10.16 | 10.52,10.16 10.52,11.15 | 10.52,11.15 10.79,11.43 | SPF3.4 10.52,11.15
PF4/D58
  Top 0.406: SPF2.4 43.46,11.15 0~2.5
  Bottom 0.406: SPF2.3 SPF2.4
PF7/D61
  Top 0.406: ESTOP.6 ESTOP.4 ESTOP.2 49.53,19.05 52.07,16.51 52.07,10.16 0~2.8
PG5/D4  (2 unrouted)
  Top 0.406: LED2.C 31.59,40.8 31.75,40.64 | LED3.A 31.75,41.27 33.02,41.91 33.02,53.98 33.66,54.61 38.1,54.61 0~1.5
PH2
  Top 0.406: J10.1 VCC_J3.8
PH3/D6  (1 unrouted)
PH4/D7  (1 unrouted)
PH5/D8  (1 unrouted)
PH6/D9  (1 unrouted)
  Top 0.406: R12.2 23.98,53.19 8~1.2
PH7
  Top 0.406: J10.2 VCC_J3.7
PJ2
  Top 0.305: J10.3 VCC_J3.6
PJ3
  Top 0.305: J10.4 VCC_J3.5
PJ4
  Top 0.406: J10.5 VCC_J3.4
PJ5
  Top 0.406: J10.6 VCC_J3.3
PJ6
  Top 0.406: J10.7 VCC_J3.2
PJ7
  Top 0.406: J10.8 VCC_J3.1
PL0/D49
  Top 0.406: D46~.4 61.59,22.86 62.87,24.13 90.17,24.13 JP1.9 I2C1.1
PL1/D48
  Top 0.406: D46~.3 63.5,29.21 106.05,29.21 113.03,22.23 JP5.9 I2C2.1
REF2  (1 unrouted)
  Top 0.406: VALVE2.4 VALVE2.3 107,61.91 R9.1 | R8.2 107,56.2 107.31,56.52
REF3  (1 unrouted)
  Top 0.406: VALVE3.4 VALVE3.3 126.69,61.91 R11.1 | R10.2 126.69,56.2 127,56.52
REF_1  (1 unrouted)
  Top 0.406: VALVE1.4 VALVE1.3 86.68,61.91 R7.1 | R6.2 86.68,56.84 87,56.52
RESET_1280  (1 unrouted)
  Top 0.406: ISP.3 48.26,29.21 45.72,29.21 ISP1.3
VDD5V  (via drill 0.6)  (2 unrouted)
  Top 0.305: C15.1 77.47,57.78
  Top 0.406: 96.2,55.56 C13.1 v96.52,53.34 96.52,47.62 97.79,46.35 IC3.12 | 116.2,55.88 C11.1 v116.2,53.34 116.2,48.26 118.11,46.35 IC4.12 | ISP.6 50.8,36.83 48.26,36.83 ISP1.6 | C12.1 v137.79,53.34 | IC2.12 82.55,46.35 82.87,46.74 82.87,51.82 v80.64,53.34 | 77.47,57.15 UART1A.1 | C14.1 104.78,11.43 JP5.2
  Top 1.016: 20.32,31.11 23.5,31.11 C17.1 | C16.1 20.32,31.11 | 20.32,31.11 IC1.3
  Top 1.676: 5VDC.2 5VDC.4 5VDC.6 10.16,46.99 11.43,45.72 11.43,32.38 12.7,31.11 IC1.3
  Bottom 1.016: VCC_J1.1 VCC_J1.2 VCC_J1.3 VCC_J1.4 VCC_J1.5 VCC_J1.6 VCC_J1.7 VCC_J1.8 | v137.79,53.34 v116.2,53.34 v96.52,53.34 v80.64,53.34 77.47,53.34 UART1A.1
  Bottom 1.676: VCC_J1.8 77.47,11.43 | 77.47,11.43 JP1.2 JP1.1 JP5.2 JP5.1 JP2.2 JP2.1 135.25,11.43 136.53,12.7 136.53,38.73 139.06,41.27 139.06,52.07 v137.79,53.34 | 59.69,2.54 72.47,2.54 77.47,7.54 77.47,11.43 | 59.69,2.54 27.3,2.54 24.13,5.71 J11.4 24.13,22.23 IC1.3 | 59.69,2.54 I2C.1
W_1
  Top 0.406: IC2.16 84.45,41.27 85.09,41.91 85.09,60.96 VALVE1.1 VALVE1.2
W_2
  Top 0.406: IC3.16 104.78,41.27 105.41,41.91 105.41,60.96 VALVE2.1 VALVE2.2
W_3
  Top 0.406: IC4.16 124.46,41.27 125.09,41.91 125.09,60.96 VALVE3.1 VALVE3.2

### Text on the board
tPlace: VO | REF | +10 | -10 | VO | REF | +10 | -10 | VO | REF | +10 | -10 | A4 | A2 | A1 | A0 | TX0 | RX0 | 14 | 15 | 16 | 17 | 18 | 19 | TX3 | RX3 | TX2 | RX2 | TX1 | RX1 | AREF | GND | 1 | 1 | 1 | 1 | 9 | 8 | 7 | 6 | 5 | 4 | 3 | 2 | 1 | 0 | 3 | 2 | 1 | 0 | 22 | 38 | PH2 | 23 | 39 | PH7 | 24 | 40 | PJ2 | 25 | 41 | GND | PJ3 | +24V | 26 | 42 | PJ4 | 1 | 27 | 43 | PJ5 | 28 | 44 | PJ6 | 29 | 45 | PJ7 | 30 | 46 | PD4 | 8 | 31 | 47 | PD5 | 9 | GND | 32 | 48 | PD6 | 10 | 33 | 49 | PG4 | 11 | 34 | 50 | PG3 | 12 | 35 | 51 | PE7 | 13 | ANALOG IN | 36 | 52 | 14 | Knuckle2 | PE6 | Knuckle1 | 37 | 53 | PE2 | 15 | POWER | Knuckle3 | RST | 3V3 | 5V | GND | Vin | 0 | 1 | 2 | 3 | 4 | 5 | 6 | 7 | GND | SCL | SDA | 21 | 20
_tsilk: VCC